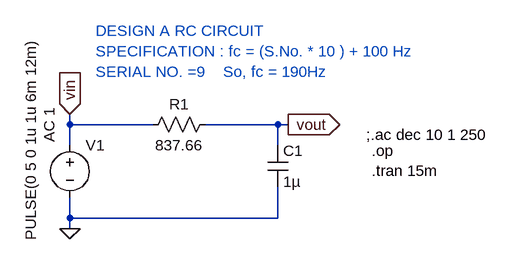
[diagram p0: schematic Rc_schematic.asc]
Rc_schematic.asc, the LTspice schematic file:
Version 4
SHEET 1 952 680
WIRE 16 128 16 112
WIRE 144 128 16 128
WIRE 336 128 224 128
WIRE 352 128 336 128
WIRE 16 160 16 128
WIRE 336 160 336 128
WIRE 16 272 16 240
WIRE 336 272 336 224
WIRE 336 272 16 272
WIRE 16 288 16 272
FLAG 16 288 0
FLAG 352 128 vout
IOPIN 352 128 Out
FLAG 16 112 vin
IOPIN 16 112 In
SYMBOL res 240 112 R90
WINDOW 0 0 56 VBottom 2
WINDOW 3 32 56 VTop 2
SYMATTR InstName R1
SYMATTR Value 837.66
SYMBOL cap 320 160 R0
SYMATTR InstName C1
SYMATTR Value 1µ
SYMBOL voltage 16 144 R0
WINDOW 3 -60 -148 VRight 2
WINDOW 123 -32 -42 VRight 2
WINDOW 39 0 0 Left 0
SYMATTR Value PULSE(0 5 0 1u 1u 6m 12m)
SYMATTR Value2 AC 1
SYMATTR InstName V1
TEXT 472 144 Left 2 !;.ac dec 10 1 250
TEXT 480 168 Left 2 !.op\n.tran 15m
TEXT 56 -16 Left 2 ;DESIGN A RC CIRCUIT \nSPECIFICATION : fc = (S.No. * 10 ) + 100 Hz   \nSERIAL NO. =9    So, fc = 190Hz

The netlist it stands for:
* Rc_schematic.asc
R1 vout vin 837.66
C1 vout 0 1µ
V1 vin 0 PULSE(0 5 0 1u 1u 6m 12m) AC 1
;.ac dec 10 1 250
.op
.tran 15m
* DESIGN A RC CIRCUIT
* SPECIFICATION : fc = (S.No. * 10 ) + 100 Hz
* SERIAL NO. =9    So, fc = 190Hz
.backanno
.end